# EAGLE design ACNode (EAGLE 6.1)
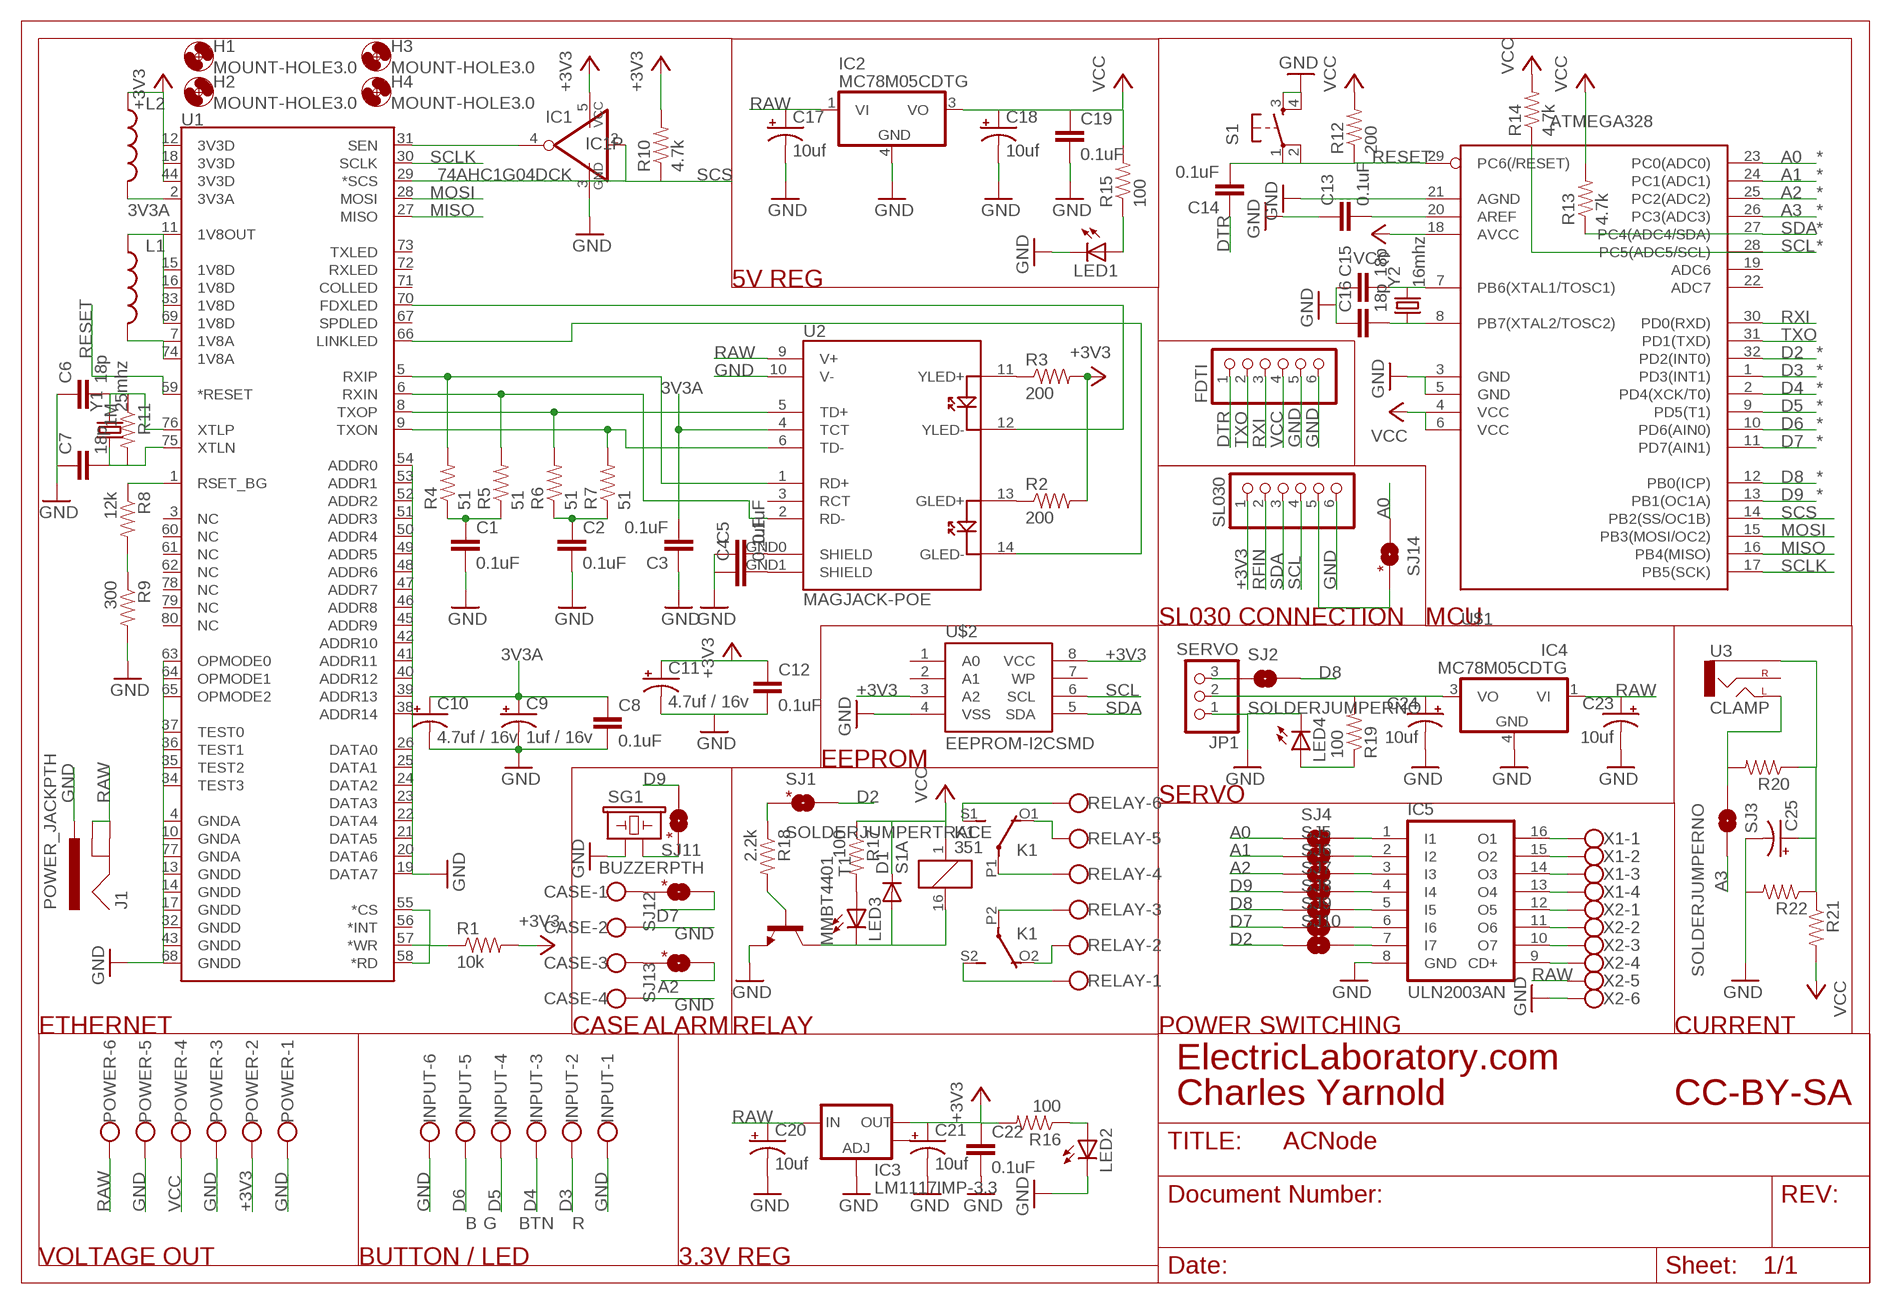
[diagram p0: schematic, sheet 1]

## Parts
C1  0.1uF  CAP0603-CAP  [0603-CAP]
C2  0.1uF  CAP0603-CAP  [0603-CAP]
C3  0.1uF  CAP0603-CAP  [0603-CAP]
C4  0.1uF  CAP0603-CAP  [0603-CAP]
C5  0.1uF  CAP0603-CAP  [0603-CAP]
C6  18p  CAP0603-CAP  [0603-CAP]
C7  18p  CAP0603-CAP  [0603-CAP]
C8  0.1uF  CAP0603-CAP  [0603-CAP]
C9  1uf / 16v  CAP_POL1206  [EIA3216]
C10  4.7uf / 16v  CAP_POL1206  [EIA3216]
C11  4.7uf / 16v  CAP_POL1206  [EIA3216]
C12  0.1uF  CAP0603-CAP  [0603-CAP]
C13  0.1uF  CAP0603-CAP  [0603-CAP]
C14  0.1uF  CAP0603-CAP  [0603-CAP]
C15  18p  CAP0603-CAP  [0603-CAP]
C16  18p  CAP0603-CAP  [0603-CAP]
C17  10uf  CAP_POL1206  [EIA3216]
C18  10uf  CAP_POL1206  [EIA3216]
C19  0.1uF  CAP0603-CAP  [0603-CAP]
C20  10uf  CAP_POL1206  [EIA3216]
C21  10uf  CAP_POL1206  [EIA3216]
C22  0.1uF  CAP0603-CAP  [0603-CAP]
C23  10uf  CAP_POL1206  [EIA3216]
C24  10uf  CAP_POL1206  [EIA3216]
C25  CAP_POL1206  [EIA3216]
CASE  W237-4  [W237-4]
D1  S1A  DIODE-DO-214AC  [DO-214AC]
FDTI  PINHD-1X6  [1X06]
H1  MOUNT-HOLE3.0  [3,0]
H2  MOUNT-HOLE3.0  [3,0]
H3  MOUNT-HOLE3.0  [3,0]
H4  MOUNT-HOLE3.0  [3,0]
IC1  74AHC1G04DCK  [SC70-5]
IC2  MC78M05CDTG  [DPACK_3]
IC3  LM1117IMP-3.3  V_REG_LM1117SOT223  [SOT223]
IC4  MC78M05CDTG  [DPACK_3]
IC5  ULN2003AN  [DIL16]
INPUT  W237-6  [W237-6]
J1  POWER_JACKPTH  [POWER_JACK_PTH]
JP1  SERVO  PINHD-1X3  [1X03]
K1  351  [351]
L1  INDUCTOR1206H*  [INDUCTOR-1206]
L2  INDUCTOR1206H*  [INDUCTOR-1206]
LED1  LED0603  [LED-0603]
LED2  LED0603  [LED-0603]
LED3  LED0603  [LED-0603]
LED4  LED0603  [LED-0603]
POWER  W237-6  [W237-6]
R1  10k  RESISTOR0603-RES  [0603-RES]
R2  200  RESISTOR0603-RES  [0603-RES]
R3  200  RESISTOR0603-RES  [0603-RES]
R4  51  RESISTOR0603-RES  [0603-RES]
R5  51  RESISTOR0603-RES  [0603-RES]
R6  51  RESISTOR0603-RES  [0603-RES]
R7  51  RESISTOR0603-RES  [0603-RES]
R8  12k  RESISTOR0603-RES  [0603-RES]
R9  300  RESISTOR0603-RES  [0603-RES]
R10  4.7k  RESISTOR0603-RES  [0603-RES]
R11  1M  RESISTOR0603-RES  [0603-RES]
R12  200  RESISTOR0603-RES  [0603-RES]
R13  4.7k  RESISTOR0603-RES  [0603-RES]
R14  4.7k  RESISTOR0603-RES  [0603-RES]
R15  100  RESISTOR0603-RES  [0603-RES]
R16  100  RESISTOR0603-RES  [0603-RES]
R17  100  RESISTOR0603-RES  [0603-RES]
R18  2.2k  RESISTOR0603-RES  [0603-RES]
R19  100  RESISTOR0603-RES  [0603-RES]
R20  RESISTOR0603-RES  [0603-RES]
R21  RESISTOR0603-RES  [0603-RES]
R22  RESISTOR0603-RES  [0603-RES]
RELAY  W237-6  [W237-6]
S1  TAC_SWITCHSMD  [TACTILE_SWITCH_SMD]
SG1  BUZZERPTH  [BUZZER-12MM]
SJ1  SOLDERJUMPERTRACE  [SJ_2S-TRACE]
SJ2  SOLDERJUMPERNO  [SJ_2S-NO]
SJ3  SOLDERJUMPERNO  [SJ_2S-NO]
SJ4  SOLDERJUMPERNO  [SJ_2S-NO]
SJ5  SOLDERJUMPERNO  [SJ_2S-NO]
SJ6  SOLDERJUMPERNO  [SJ_2S-NO]
SJ7  SOLDERJUMPERNO  [SJ_2S-NO]
SJ8  SOLDERJUMPERNO  [SJ_2S-NO]
SJ9  SOLDERJUMPERNO  [SJ_2S-NO]
SJ10  SOLDERJUMPERNO  [SJ_2S-NO]
SJ11  SOLDERJUMPERTRACE  [SJ_2S-TRACE]
SJ12  SOLDERJUMPERTRACE  [SJ_2S-TRACE]
SJ13  SOLDERJUMPERTRACE  [SJ_2S-TRACE]
SJ14  SOLDERJUMPERTRACE  [SJ_2S-TRACE]
SL030  PINHD-1X6  [1X06]
T1  MMBT4401  MMBT4401LT1-NPN-SOT23-BEC  [SOT23-BEC]
U1  W5100  [LQFP-80]
U2  MAGJACK-POE  [MAGJACK-POE]
U3  CLAMP  AUDIO-JACKPTH  [AUDIO-JACK]
U$1  ATMEGA328  AVR-MEGA8-AI  [TQFP32-08]
U$2  EEPROM-I2CSMD  [SO08]
X1  W237-4  [W237-4]
X2  W237-6  [W237-6]
Y1  25mhz  CRYSTALSMD  [HC49UP]
Y2  16mhz  CRYSTALSMD  [HC49UP]

## Nets
3V3A: C3.2 C8.1 C9.A(+) C10.A(+) L2.P$2 U1.2(3V3A) U2.4(TCT)
+3V3: C11.A(+) C12.1 C21.A(+) C22.1 IC1.5(VCC) IC3.2(OUT) L2.P$1 POWER.2 R1.2 R2.2 R3.2 R10.2 R16.2 SL030.1 U1.12(3V3D) U1.18(3V3D) U1.44(3V3D) U$2.3(A2) U$2.8(VCC)
A0: SJ4.1 SJ14.1 U$1.23(PC0(ADC0))
A1: SJ5.1 U$1.24(PC1(ADC1))
A2: SJ6.1 SJ13.2 U$1.25(PC2(ADC2))
A3: SJ3.2 U$1.26(PC3(ADC3))
D2: SJ1.2 SJ10.1 U$1.32(PD2(INT0))
D3: INPUT.2 U$1.1(PD3(INT1))
D4: INPUT.3 U$1.2(PD4(XCK/T0))
D5: INPUT.4 U$1.9(PD5(T1))
D6: INPUT.5 U$1.10(PD6(AIN0))
D7: SJ9.1 SJ12.2 U$1.11(PD7(AIN1))
D8: SJ2.2 SJ8.1 U$1.12(PB0(ICP))
D9: SJ7.1 SJ11.2 U$1.13(PB1(OC1A))
DTR: C14.1 FDTI.1
GND: C1.2 C2.2 C3.1 C4.1 C5.1 C6.1 C7.1 C8.2 C9.C(-) C10.C(-) C11.C(-) C12.2 C13.1 C15.1 C16.1 C17.C(-) C18.C(-) C19.2 C20.C(-) C21.C(-) C22.2 C23.C(-) C24.C(-) C25.C(-) CASE.2 CASE.4 FDTI.5 FDTI.6 IC1.3(GND) IC2.4(GND) IC3.1(ADJ) IC4.4(GND) IC5.8(GND) INPUT.1 INPUT.6 J1.PWR JP1.1 LED1.C LED2.C LED4.C POWER.1 POWER.3 POWER.5 R9.2 R22.2 S1.3 S1.4 SG1.+ SL030.6 T1.E U1.4(GNDA) U1.10(GNDA) U1.13(GNDD) U1.14(GNDD) U1.17(GNDD) U1.19(DATA7) U1.20(DATA6) U1.21(DATA5) U1.22(DATA4) U1.23(DATA3) U1.24(DATA2) U1.25(DATA1) U1.26(DATA0) U1.32(GNDD) U1.34(TEST3) U1.35(TEST2) U1.36(TEST1) U1.37(TEST0) U1.38(ADDR14) U1.39(ADDR13) U1.40(ADDR12) U1.41(ADDR11) U1.42(ADDR10) U1.43(GNDD) U1.45(ADDR9) U1.46(ADDR8) U1.47(ADDR7) U1.48(ADDR6) U1.49(ADDR5) U1.50(ADDR4) U1.51(ADDR3) U1.52(ADDR2) U1.53(ADDR1) U1.54(ADDR0) U1.63(OPMODE0) U1.64(OPMODE1) U1.65(OPMODE2) U1.68(GNDD) U1.77(GNDA) U2.10(V-) U$1.3(GND) U$1.5(GND) U$1.21(AGND) U$2.4(VSS) X2.6
MISO: U1.27(MISO) U$1.16(PB4(MISO))
MOSI: U1.28(MOSI) U$1.15(PB3(MOSI/OC2))
N$1: IC1.4(O) U1.31(SEN)
N$2: C13.2 U$1.20(AREF)
N$3: C2.1 R6.1 R7.1
N$4: C1.1 R4.1 R5.1
N$5: L1.P$2 U1.7(1V8A) U1.74(1V8A)
N$6: L1.P$1 U1.11(1V8OUT) U1.15(1V8D) U1.16(1V8D) U1.33(1V8D) U1.69(1V8D)
N$7: R1.1 U1.55(*CS) U1.57(*WR) U1.58(*RD)
N$8: R8.2 R9.1
N$9: R6.2 U1.8(TXOP) U2.5(TD+)
N$10: R7.2 U1.9(TXON) U2.6(TD-)
N$11: R4.2 U1.5(RXIP) U2.1(RD+)
N$12: R5.2 U1.6(RXIN) U2.2(RD-)
N$13: R3.1 U2.11(YLED+)
N$14: R2.1 U2.13(GLED+)
N$15: R8.1 U1.1(RSET_BG)
N$16: U1.70(FDXLED) U2.12(YLED-)
N$17: U1.66(LINKLED) U2.14(GLED-)
N$18: C5.2 U2.GND0(SHIELD)
N$19: C4.2 U2.GND1(SHIELD)
N$20: C7.2 R11.2 U1.75(XTLN) Y1.1
N$21: C6.2 R11.1 U1.76(XTLP) Y1.2
N$22: C15.2 U$1.7(PB6(XTAL1/TOSC1)) Y2.2
N$23: SG1.- SJ11.1
N$24: C16.2 U$1.8(PB7(XTAL2/TOSC2)) Y2.1
N$25: K1.S2(3:S) RELAY.1
N$26: LED1.A R15.1
N$27: K1.O2(3:O) RELAY.2
N$28: LED2.A R16.1
N$29: K1.P2(3:P) RELAY.3
N$30: K1.P1(2:P) RELAY.4
N$31: K1.O1(2:O) RELAY.5
N$32: K1.S1(2:S) RELAY.6
N$33: LED3.A R17.2
N$34: D1.A K1.16 LED3.C T1.C
N$35: R18.2 T1.B
N$36: LED4.A R19.1
N$37: R18.1 SJ1.1
N$38: C24.A(+) IC4.3(VO) JP1.2 R19.2
N$39: JP1.3 SJ2.1
N$40: C25.A(+) R20.1 R21.1 R22.1 U3.SLEEVE
N$41: R20.2 SJ3.1 U3.TIP(LEFT)
N$42: IC5.16(O1) X1.1
N$43: IC5.15(O2) X1.2
N$44: IC5.14(O3) X1.3
N$45: IC5.13(O4) X1.4
N$46: IC5.12(O5) X2.1
N$47: IC5.11(O6) X2.2
N$48: IC5.10(O7) X2.3
N$49: IC5.9(CD+) X2.4
N$50: IC5.7(I7) SJ10.2
N$51: IC5.6(I6) SJ9.2
N$52: IC5.5(I5) SJ8.2
N$53: IC5.4(I4) SJ7.2
N$54: IC5.3(I3) SJ6.2
N$55: IC5.2(I2) SJ5.2
N$56: IC5.1(I1) SJ4.2
N$57: SJ14.2 SL030.5
N$58: CASE.1 SJ12.1
N$59: CASE.3 SJ13.1
RAW: C17.A(+) C20.A(+) C23.A(+) IC2.1(VI) IC3.3(IN) IC4.1(VI) J1.GND J1.GNDBREAK POWER.6 U2.9(V+) X2.5
RESET: C14.2 R12.1 S1.1 S1.2 U1.59(*RESET) U$1.29(PC6(/RESET))
RFIN: SL030.2
RXI: FDTI.3 U$1.30(PD0(RXD))
SCL: R14.1 SL030.4 U$1.28(PC5(ADC5/SCL)) U$2.6(SCL)
SCLK: U1.30(SCLK) U$1.17(PB5(SCK))
SCS: IC1.2(I) R10.1 U1.29(*SCS) U$1.14(PB2(SS/OC1B))
SDA: R13.1 SL030.3 U$1.27(PC4(ADC4/SDA)) U$2.5(SDA)
TXO: FDTI.2 U$1.31(PD1(TXD))
VCC: C18.A(+) C19.1 D1.C FDTI.4 IC2.3(VO) K1.1 POWER.4 R12.2 R13.2 R14.2 R15.2 R17.1 R21.2 U$1.4(VCC) U$1.6(VCC) U$1.18(AVCC)
Unconnected: IC3.4(OUT) U1.3(NC) U1.56(*INT) U1.60(NC) U1.61(NC) U1.62(NC) U1.67(SPDLED) U1.71(COLLED) U1.72(RXLED) U1.73(TXLED) U1.78(NC) U1.79(NC) U1.80(NC) U2.3(RCT) U3.RING(RIGHT) U$1.19(ADC6) U$1.22(ADC7) U$2.1(A0) U$2.2(A1) U$2.7(WP)

## Notes on the sheet
- *
- *
- *
- *
- *
- *
- 5V REG
- *
- *
- *
- *
- *
- *
- *
- *
- *
- SL030 CONNECTION | MCU
- EEPROM
- * | SERVO
- *
- *
- *
- ETHERNET | CASE | ALARM | RELAY | POWER SWITCHING | CURRENT
- ElectricLaboratory.com
- Charles Yarnold | CC-BY-SA
- B | G | BTN | R
- VOLTAGE OUT | BUTTON / LED | 3.3V REG

## Library data of the parts
C1-C8 C12-C16 C19 C22 = SparkFun-Passives:CAP: Capacitor Standard 0603 ceramic capacitor, and 0.1" leaded capacitor.
C9-C11 C17 C18 C20 C21 C23-C25 = SparkFun-Passives:CAP_POL: Capacitor Polarized These are standard SMD and PTH capacitors. Normally 10uF, 47uF, and 100uF in electrolytic and tantalum varieties. Always verify the external diameter of the through hole cap, it varies with capacity, voltage, and manufacturer. The EIA devices should be standard.
CASE X1 = con-wago-500:W237-4: WAGO SCREW CLAMP; OC_FARNELL: unknown; OC_NEWARK: unknown
D1 = diode:DIODE-: DIODE
FDTI SL030 = pinhead:PINHD-1X6: PIN HEADER
H1-H4 = holes:MOUNT-HOLE: MOUNTING HOLE with drill center marker
IC1 = 74xx-little-de:74*1G04: INVERTER Gate
IC2 IC4 = linear:MC78M: 500 mA Positive Voltage Regulators Source: Data sheet <http://www.onsemi.com/pub_link/Collateral/MC78M00-D.PDF>
IC3 = SparkFun-PowerIC:V_REG_LM1117: Voltage Regulator LM1117 Standard adjustable voltage regulator but in SMD form. Spark Fun Electronics SKU : COM-00595
IC5 = uln-udn:ULN2003A: DRIVER ARRAY
INPUT POWER RELAY X2 = con-wago-500:W237-6: WAGO SCREW CLAMP; OC_FARNELL: unknown; OC_NEWARK: unknown
J1 = SparkFun-Connectors:POWER_JACK: Power Jack This is the standard 5.5mm barrel jack for power. The PTH is the most common, proven, reliable, footprint. All others are experimental. The Slot footprint only works if the mill layer is transmitted to the PCB fab house so be warned. Spark Fun Electronics SKU : PRT-00119. Mating wall wart : TOL-00298 (and others)
JP1 = pinhead:PINHD-1X3: PIN HEADER
K1 = relay:351: RELAY 2 x switch, Omron; OC_FARNELL: unknown; OC_NEWARK: unknown
L1 L2 = SparkFun-Passives:INDUCTOR: Inductors Basic Inductor/Choke - 0603 and 1206. Footprints are not proven and vary greatly between part numbers.
LED1-LED4 = SparkFun-LED:LED: LEDs Standard schematic elements and footprints for 5mm, 3mm, 1206, and 0603 sized LEDs. 5mm - Spark Fun Electronics SKU : COM-00529 (and others)
R1-R22 = SparkFun-Passives:RESISTOR: Resistor Basic schematic elements and footprints for 0603, 1206, and PTH resistors.
S1 = SparkFun-Electromechanical:TAC_SWITCH: Momentary Switch Button commonly used for reset or general input. Spark Fun Electronics SKU : COM-00097
SG1 = SparkFun-Electromechanical:BUZZER: Buzzer 12mm Spark Fun Electronics SKU : Comp-Buzzer
SJ1-SJ14 = SparkFun-Passives:SOLDERJUMPER: Solder Jumper Standard SMD solder jumper. Used to automate production. Two varients : Normally Open and Normally Closed are the same, but have different paste layers. NC will have a large amount of paste and should jumper during reflow.
T1 = transistor:*-NPN-: NPN Transistror BF959 corrected 2008.03.06
U1 = SparkFun-DigitalIC:W5100: WIZnet W5100 TCP/IP PHY Embedded Chip See SparkFun catalog # COM-09471 Package: LQFP-80,10x10mm, 0.4mm pitch
U2 = SparkFun-Connectors:MAGJACK-POE: PoE compatible MagJack
U3 = SparkFun-Connectors:AUDIO-JACK: 3.5mm Audio Jack Simple 3.5mm common PCB mount audio jack. SKU: PRT-08032
U$1 = SparkFun-DigitalIC:AVR-MEGA8: MICROCONTROLLER 8 Kbytes FLASH 1 kbytes SRAM 512 bytes EEPROM USART 6-channel 10 bit ADC 2-channel 8 bit ADC
U$2 = SparkFun-DigitalIC:EEPROM-I2C: I2C EEPROM chips, 24LC256 (and others)
Y1 Y2 = SparkFun-FreqCtrl:CRYSTAL: Various standard crystals. Proven footprints. Spark Fun Electronics SKU : COM-00534

## Board
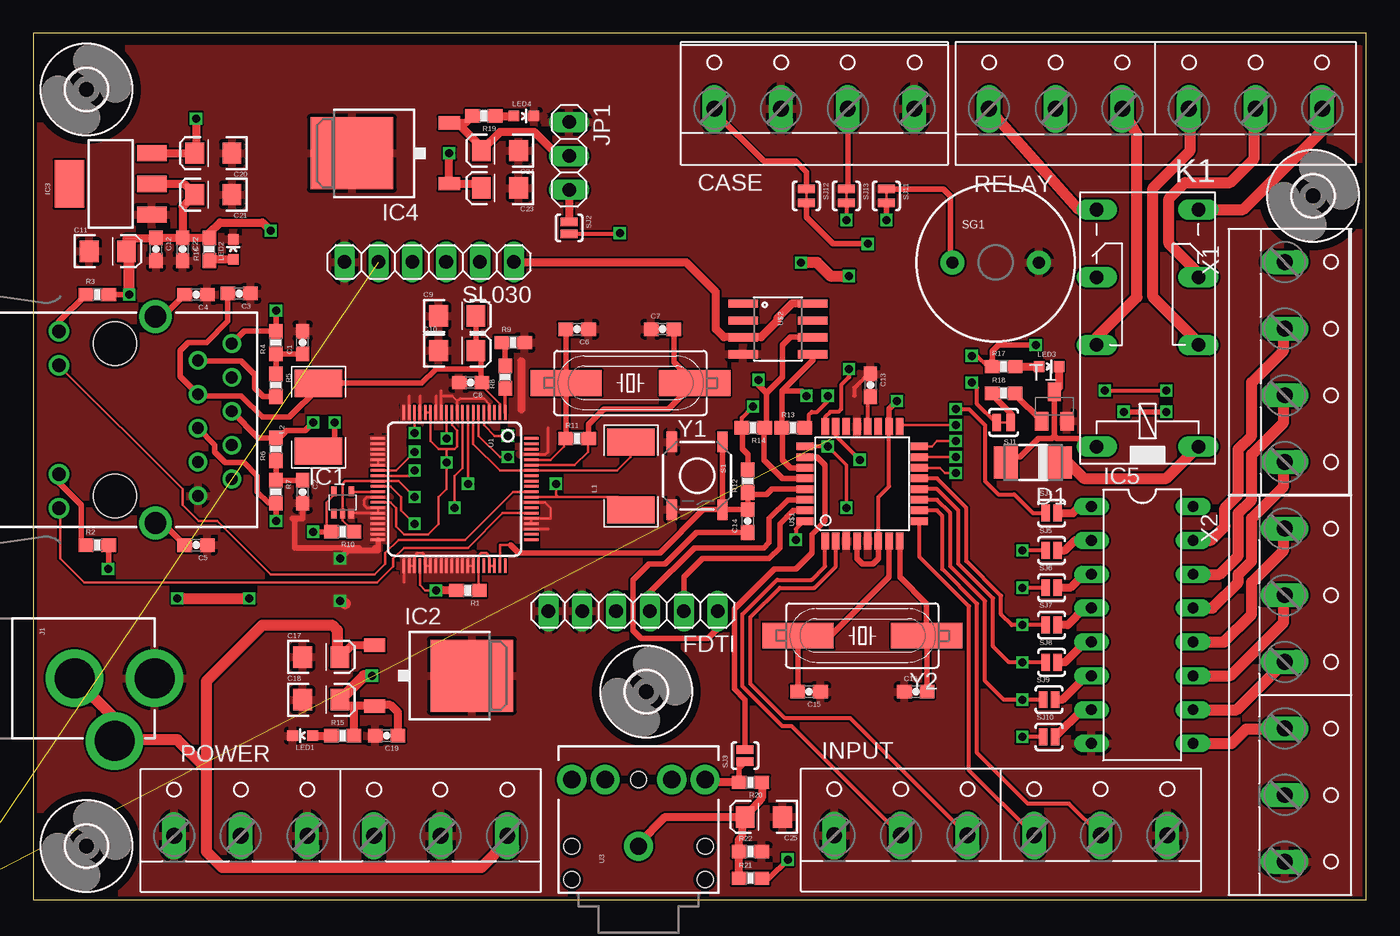
[diagram p1: board, top side]
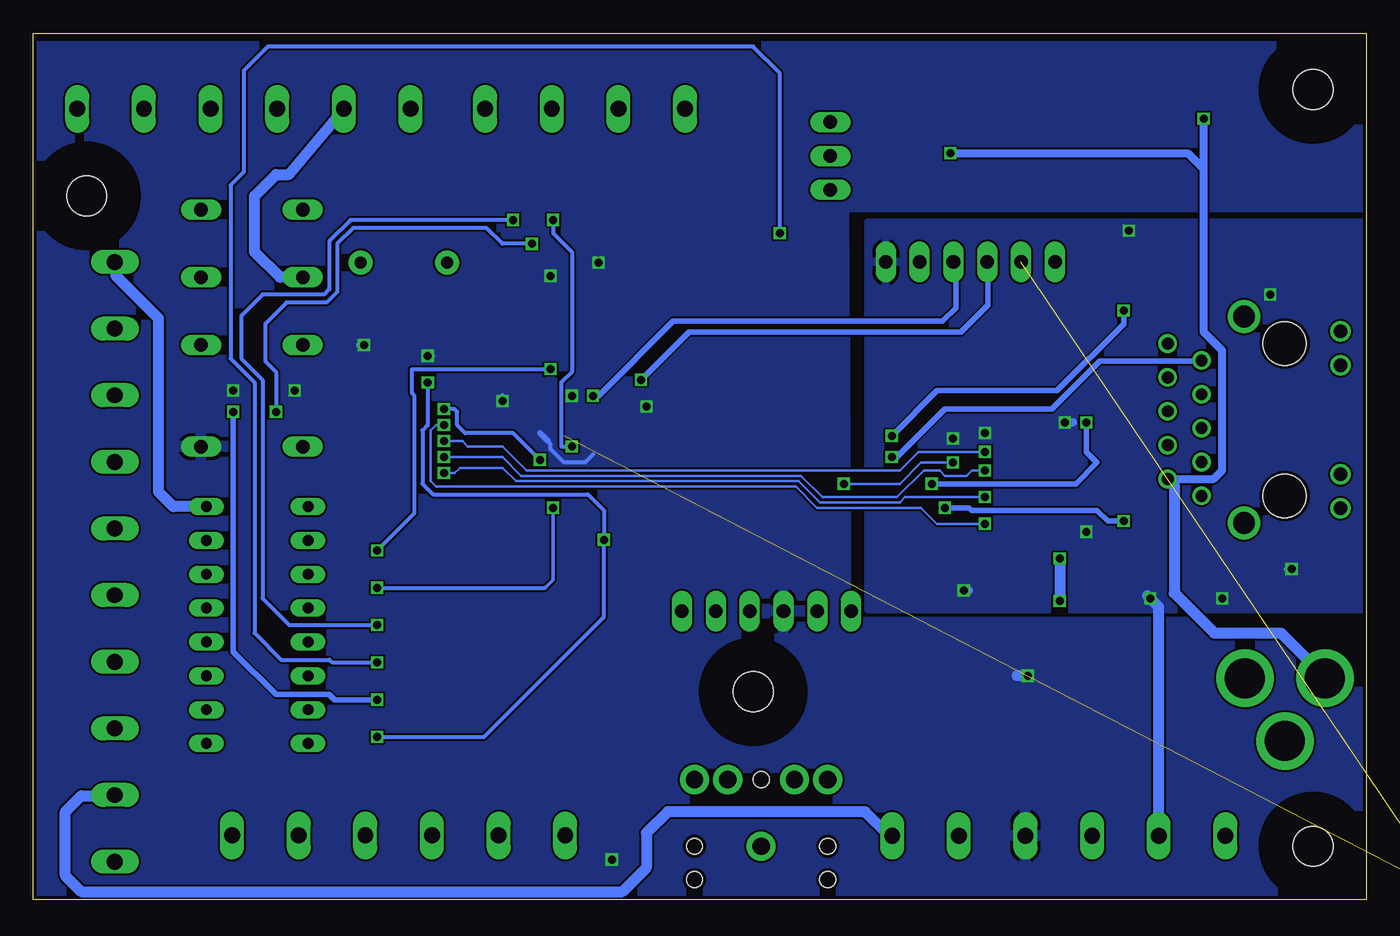
[diagram p2: board, bottom side, seen from below]

Size 100 x 65 mm. Coordinates in mm from the lower left corner, seen from the top.
Outline: 0,0 100,0 100,65 0,65 0,0
Copper layers (1*16): Top 0.035mm / dielectric 1.5mm / Bottom 0.035mm
Design rules: minimum track width 6mil, minimum drill 12mil, track to track 6mil, track to pad 6mil, pad to pad 6mil, via to via 6mil, smd to smd 0mil, copper to edge 10mil, drill to drill 10mil, minimum pad ring 10mil, minimum via ring 6mil, stop-mask expansion 2mil, vias tented up to drill 100mil, thermal gap 10mil

### Footprints (pad centres in the part's own frame; a part is rotated, then mirrored left to right if it is on the bottom)
0603-CAP = smd 1.1 x 1: 1 -0.85,0; 2 0.85,0
EIA3216 = smd 1.4 x 1.6: A 1.4,0; C -1.4,0
W237-4 = drill 1.194 long: 1 -7.5,-1.27; 2 -2.5,-1.27; 3 2.5,-1.27; 4 7.5,-1.27
DO-214AC = smd 1.8 x 2.4: A 2.025,0; C -2.025,0
1X06 = drill 1.016 long: 1 -6.35,0; 2 -3.81,0; 3 -1.27,0; 4 1.27,0; 5 3.81,0; 6 6.35,0
3,0 = hole 3: 0,0
SC70-5 = smd 0.4 x 0.7: 1 -0.65,-0.85; 2 0,-0.85; 3 0.65,-0.85; 4 0.65,0.85; 5 -0.65,0.85
DPACK_3 = smd 1 x 1.6: 1 -2.28,-4.8; 3 2.28,-4.8 | smd 5.4 x 6.2: 4 0,2.5
SOT223 = smd 1.219 x 2.235: 1 -2.311,-3.099; 2 0,-3.099; 3 2.311,-3.099 | smd 3.6 x 2.2: 4 0,3.099
DIL16 = drill 0.813 long: 1 -8.89,-3.81; 2 -6.35,-3.81; 3 -3.81,-3.81; 4 -1.27,-3.81; 5 1.27,-3.81; 6 3.81,-3.81; 7 6.35,-3.81; 8 8.89,-3.81; 9 8.89,3.81; 10 6.35,3.81; 11 3.81,3.81; 12 1.27,3.81; 13 -1.27,3.81; 14 -3.81,3.81; 15 -6.35,3.81; 16 -8.89,3.81
W237-6 = drill 1.194 long: 1 -12.5,-1.27; 2 -7.5,-1.27; 3 -2.5,-1.27; 4 2.5,-1.27; 5 7.5,-1.27; 6 12.5,-1.27
POWER_JACK_PTH = drill 2.997 pad 4.318: GND 0,7.7; GNDBREAK 4.7,10.7; PWR 0,13.7
1X03 = drill 1.016 long: 1 -2.54,0; 2 0,0; 3 2.54,0
351 = drill 1.016 long: 1 -3.81,-3.81; 16 -3.81,3.81; O1 8.89,-3.81; O2 8.89,3.81; P1 3.81,-3.81; P2 3.81,3.81; S1 13.97,-3.81; S2 13.97,3.81
INDUCTOR-1206 = smd 2.032 x 3.556: P$1 -2.54,0; P$2 2.54,0
LED-0603 = smd 0.8 x 0.8: A 0,-0.75; C 0,0.75
0603-RES = smd 1.1 x 1: 1 -0.85,0; 2 0.85,0
TACTILE_SWITCH_SMD = smd 1.524 x 0.762: 1 -2.54,1.905; 2 2.54,1.905; 3 -2.54,-1.905; 4 2.54,-1.905
BUZZER-12MM = drill 0.9 pad 1.778: + 3.25,0; - -3.25,0
SJ_2S-TRACE = smd 0.635 x 1.27: 1 -0.508,0; 2 0.508,0
SJ_2S-NO = smd 0.635 x 1.27: 1 -0.45,0; 2 0.45,0
SOT23-BEC = smd 1 x 1.4: B -0.95,-1.1; C 0,1.1; E 0.95,-1.1
LQFP-80 = smd 0.19 x 1.1: 1 -3.8,-5.75; 2 -3.4,-5.75; 3 -3,-5.75; 4 -2.6,-5.75; 5 -2.2,-5.75; 6 -1.8,-5.75; 7 -1.4,-5.75; 8 -1,-5.75; 9 -0.6,-5.75; 10 -0.2,-5.75; 11 0.2,-5.75; 12 0.6,-5.75; 13 1,-5.75; 14 1.4,-5.75; 15 1.8,-5.75; 16 2.2,-5.75; 17 2.6,-5.75; 18 3,-5.75; 19 3.4,-5.75; 20 3.8,-5.75; 41 3.8,5.75; 42 3.4,5.75; 43 3,5.75; 44 2.6,5.75; 45 2.2,5.75; 46 1.8,5.75; 47 1.4,5.75; 48 1,5.75; 49 0.6,5.75; 50 0.2,5.75; 51 -0.2,5.75; 52 -0.6,5.75; 53 -1,5.75; 54 -1.4,5.75; 55 -1.8,5.75; 56 -2.2,5.75; 57 -2.6,5.75; 58 -3,5.75; 59 -3.4,5.75; 60 -3.8,5.75 | smd 1.1 x 0.19: 21 5.75,-3.8; 22 5.75,-3.4; 23 5.75,-3; 24 5.75,-2.6; 25 5.75,-2.2; 26 5.75,-1.8; 27 5.75,-1.4; 28 5.75,-1; 29 5.75,-0.6; 30 5.75,-0.2; 31 5.75,0.2; 32 5.75,0.6; 33 5.75,1; 34 5.75,1.4; 35 5.75,1.8; 36 5.75,2.2; 37 5.75,2.6; 38 5.75,3; 39 5.75,3.4; 40 5.75,3.8; 61 -5.75,3.8; 62 -5.75,3.4; 63 -5.75,3; 64 -5.75,2.6; 65 -5.75,2.2; 66 -5.75,1.8; 67 -5.75,1.4; 68 -5.75,1; 69 -5.75,0.6; 70 -5.75,0.2; 71 -5.75,-0.2; 72 -5.75,-0.6; 73 -5.75,-1; 74 -5.75,-1.4; 75 -5.75,-1.8; 76 -5.75,-2.2; 77 -5.75,-2.6; 78 -5.75,-3; 79 -5.75,-3.4; 80 -5.75,-3.8
MAGJACK-POE = drill 0.89: 1 5.72,-8.89; 2 4.45,-6.35; 3 3.18,-8.89; 4 1.91,-6.35; 5 0.64,-8.89; 6 -0.63,-6.35; 7 -1.9,-8.89; 8 -3.17,-6.35; 9 -4.44,-8.89; 10 -5.71,-6.35 | drill 1.02: 11 6.625,4.08; 12 4.085,4.08; 13 -4.085,4.08; 14 -6.625,4.08 | drill 1.63: GND0 -7.745,-3.17; GND1 7.745,-3.17 | hole 3.25: -5.715,-0.12; 5.715,-0.12
AUDIO-JACK = drill 1.3 pad 2.184: RING 5,5; RSH 5,2.5; SLEEVE 0,0; TIP 5,-5; TSH 5,-2.5 | hole 1.2: 0,5; -2.5,5; -2.5,-5; 0,-5; 5,0
TQFP32-08 = smd 1.27 x 0.559: 1 -4.293,2.8; 2 -4.293,2; 3 -4.293,1.2; 4 -4.293,0.4; 5 -4.293,-0.4; 6 -4.293,-1.2; 7 -4.293,-2; 8 -4.293,-2.8; 17 4.293,-2.8; 18 4.293,-2; 19 4.293,-1.2; 20 4.293,-0.4; 21 4.293,0.4; 22 4.293,1.2; 23 4.293,2; 24 4.293,2.8 | smd 0.559 x 1.27: 9 -2.8,-4.293; 10 -2,-4.293; 11 -1.2,-4.293; 12 -0.4,-4.293; 13 0.4,-4.293; 14 1.2,-4.293; 15 2,-4.293; 16 2.8,-4.293; 25 2.8,4.293; 26 2,4.293; 27 1.2,4.293; 28 0.4,4.293; 29 -0.4,4.293; 30 -1.2,4.293; 31 -2,4.293; 32 -2.8,4.293
SO08 = smd 0.61 x 2.21: 1 -1.905,-2.616; 2 -0.635,-2.616; 3 0.635,-2.616; 4 1.905,-2.616; 5 1.905,2.616; 6 0.635,2.616; 7 -0.635,2.616; 8 -1.905,2.616
HC49UP = smd 5.334 x 1.93: 1 -4.826,0; 2 4.826,0

### Placement (x,y rotation side)
C1  20.2,41.8 90 top
C2  20.2,30.6 270 top
C3  15.44,45.48 180 top
C4  12.2,45.4 180 top
C5  12.2,26.6 180 top
C6  40.8,42.8 180 top
C7  47.2,42.8 0 top
C8  32.8,38.8 180 top
C9  31.8,43.8 0 top
C10  31.8,41.2 0 top
C11  5.59,48.64 0 top
C12  9.2,48.8 270 top
C13  62.8,38.6 270 top
C14  53.6,28.4 90 top
C15  58.2,15.6 180 top
C16  66.2,15.6 0 top
C17  21.6,18.2 0 top
C18  21.6,15 0 top
C19  26.5,12.3 180 top
C20  13.5,56 180 top
C21  13.5,52.9 180 top
C22  11.2,48.8 270 top
C23  35,53.4 180 top
C24  35,56.2 180 top
C25  54.8,6.2 180 top
CASE  58.6,60.6 0 top
D1  75,32.8 180 top
FDTI  44.99,21.64 180 top
H1  46,15.6 0 top
H2  96,52.8 0 top
H3  4,60.8 0 top
H4  4,4 0 top
IC1  23.2,29.8 0 top
IC2  30.4,16.8 270 top
IC3  5.8,53.7 90 top
IC4  26.4,56 90 top
IC5  83.2,20.6 270 top
INPUT  72.59,6.08 0 top
J1  -4.6,16.6 270 top
JP1  40.2,55.8 270 top
K1  83.6,37.8 90 top
L1  44.84,31.78 90 top
L2  21.4,36.2 90 top
LED1  20.2,12.3 90 top
LED2  15,48.8 0 top
LED3  76.2,40 270 top
LED4  36.8,58.8 270 top
POWER  23.06,6.05 0 top
R1  32.6,23.2 180 top
R2  4.8,26.6 0 top
R3  4.8,45.4 0 top
R4  18.2,41.8 90 top
R5  18.2,38.6 270 top
R6  18.2,33.8 90 top
R7  18.2,30.6 270 top
R8  35.4,39.2 90 top
R9  36,41.8 0 top
R10  23.2,27.6 180 top
R11  40.8,34.6 0 top
R12  53.6,31.4 90 top
R13  57,35.4 0 top
R14  54,35.4 180 top
R15  23.2,12.3 0 top
R16  13.2,48.8 90 top
R17  72.8,40 0 top
R18  72.8,38 0 top
R19  33.8,58.8 180 top
R20  53.8,8.8 180 top
R21  53.8,1.6 0 top
R22  53.8,3.6 0 top
RELAY  84.2,60.6 0 top
S1  49.8,31.8 270 top
SG1  72.2,47.8 0 top
SJ1  72.8,35.8 180 top
SJ2  40.2,50.4 270 top
SJ3  53.4,10.8 90 top
SJ4  76.4,29 0 top
SJ5  76.4,26.2 0 top
SJ6  76.4,23.4 0 top
SJ7  76.4,20.6 0 top
SJ8  76.4,17.8 0 top
SJ9  76.2,15 0 top
SJ10  76.2,12.2 0 top
SJ11  64,52.8 270 top
SJ12  58,52.8 270 top
SJ13  61,52.8 270 top
SJ14  -7.2,-0.4 0 top  (outside the outline)
SL030  29.7,47.84 180 top
T1  76.6,37 0 top
U1  31.6,30.8 180 top
U2  6,36 90 top
U3  45.4,4 90 top
U$1  62.2,31.2 90 top
U$2  55.87,42.82 270 top
X1  95.15,40.34 270 top
X2  95.15,15.34 270 top
Y1  44.8,38.76 180 top
Y2  62.2,19.8 180 top

### Tracks (layer width: path | path; a pad name or v marks a point on that pad's centre or on a via)
3V3A
  Top 0.2: U1.2 35,37.2 33.65,38.55 C8.1
  Top 0.406: C8.1 33.6,38.85 33.6,40 | 33.6,40 33.6,40.8 C10.A C9.A | 33.6,40 33.4,39.8 30.2,39.8 29.14,38.74 L2.P$2 21.4,38.4 19.2,36.2 17.2,36.2 15.6,37.8 12.46,37.8 U2.4 11,39.26 11,41.2 11.6,41.8 13,41.8 14.59,43.39 C3.2
+3V3  (via drill 0.6)
  Top 0.2: IC1.5 22.55,30.35 22,29.8 22,27.95 R10.2 | U1.44 29,23.6 29.4,23.2 v30.2,23.2 | U1.18 v28.6,35 | U1.12 v31,34.6
  Top 0.305: 13.2,49.8 R16.2 | U$2.8 58.56,44.8
  Top 0.406: R3.2 v7.2,45.4 | v21,27.6 22,27.6 22,27.95 | v5.6,24.8 5.65,24.85 R2.2 | 21.6,33.86 L2.P$1 21.54,33.8 22.4,33.8 22.6,34 v22.6,35.8
  Top 0.61: 8.9,53.85 IC3.2 11.3,53.7 C21.A 11.2,52 C22.1 | C22.1 11.2,49.6 | R16.2 C22.1 | C22.1 C12.1 9.15,49.6 7,49.6 6.99,49.59 C11.A | R1.2 v30.2,23.2 | 13.2,49.8 13.2,50 14,50.8 17.2,50.8 v17.8,50.2 | U$2.8 56.92,44.73 55.8,43.6 55.8,43.4 54.6,42.2 53.27,42.2 | 53.27,42.2 U$2.3 | 53.27,42.2 51.8,42.2 51.2,42.8 51.2,45.6 49,47.8 36.09,47.8 SL030.1
  Top 0.813: v7.2,45.4 7.2,48 6.99,48.21 C11.A | v10.8,22.6 v16.2,22.6
  Bottom 0.2: v28.6,35 28.8,34.6 | v31,34.6 30.8,34.8
  Bottom 0.406: v5.6,24.8 6,24.8
  Bottom 0.61: v30.2,23.2 29.8,23.2 | v22.6,35.8 22,35.8
  Bottom 0.813: POWER.2 15.56,21.96 v16.2,22.6 16.4,22.8
  pour Bottom: 0,50.8 37.4,50.8 37.4,21.8 0,21.8
A0  (via drill 0.6)  (1 unrouted)
  Top 0.305: U$1.23 60.2,34.8 v62,33 | v69.2,36.8 70.2,36.8 71.4,35.6 71.4,31.4 72.4,30.4 73.6,30.4 75,29 SJ4.1
  Bottom 0.305: v62,33 64,35 67.6,35 68.2,35.6 68.2,36.6 68.4,36.8 v69.2,36.8
A1  (via drill 0.6)
  Top 0.305: SJ5.1 v74.2,26.2 | v61.2,39.8 61.2,39.2 60.6,38.6 60.6,36.8 60.4,36.6 59.8,36.6 59.4,36.2 U$1.24
  Bottom 0.305: v74.2,26.2 71.4,29 71.4,37.8 71.6,38 71.6,39.8 v61.2,39.8
A2  (via drill 0.6)
  Top 0.254: v61,29.4 61,32.6 v59.6,34
  Top 0.305: SJ6.1 v74.2,23.4 | v59.6,34 U$1.25 | SJ13.2 v61,51
  Bottom 0.254: v61,29.4 61,24 61.6,23.4
  Bottom 0.305: v74.2,23.4 61.6,23.4 | v61,51 61,50 59.6,48.6 59.6,39.6 60.4,38.8 60.4,34 v59.6,34
A3
  Top 0.406: U$1.26 58.8,33.2 59.4,32.6 59.4,28.4 58.4,27.4 58.4,26 57.2,24.8 55.6,24.8 52.6,21.8 52.6,15.8 53.4,15 SJ3.2
D2  (via drill 0.6)
  Top 0.305: SJ10.1 v74.2,12.2 | 58,28.31 U$1.32 57.8,28.4 57.2,27.8 v57.2,27 | SJ1.2 72.2,35.8 70.8,37.2 70.8,38.4 v70.4,38.8
  Bottom 0.305: v70.4,38.8 70.4,35.6 70.8,35.2 70.8,31.2 70,30.4 58.4,30.4 57.2,29.2 v57.2,27 57.2,21.2 66.2,12.2 v74.2,12.2
D3
  Top 0.305: INPUT.2 56.9,13 56.2,13 53.2,16 53.2,21.4 55.8,24 58.4,24 59.4,25 U$1.1
D4
  Top 0.305: INPUT.3 61.3,13.6 56.4,13.6 53.8,16.2 53.8,21.2 56,23.4 58.6,23.4 60.2,25 U$1.2
D5
  Top 0.305: INPUT.4 70.2,9.7 70.2,22 66.49,25.71 U$1.9
D6
  Top 0.305: INPUT.5 77.7,7.2 74.6,7.2 70.8,11 70.8,22.2 68.2,24.8 68.2,28.8 67.8,29.2 U$1.10
D7  (via drill 0.6)
  Top 0.305: SJ9.1 v74.2,15 72.8,15 71.4,16.4 71.4,22.4 68.8,25 68.8,29 67.8,30 U$1.11
  Top 0.406: SJ12.2 58,51.2 60,49.2 v62.6,49.2 | v81.8,36.6 v85,36.6 | 66.4,30 U$1.11
  Bottom 0.305: v62.6,49.2 64.8,49.2 66,50.4 76,50.4 77.2,49.2 77.2,45.6 78,44.8 81,44.8 82.6,43.2 82.6,40.4 81.8,39.6 v81.8,36.6
  Bottom 0.406: v85,36.6 85,18.6 81.8,15.4 77.8,15.4 77.4,15 v74.2,15
D8  (via drill 0.6)
  Top 0.305: 76,17.8 SJ8.1 v74.2,17.8 73.2,17.8 72,19 72,22.6 69.4,25.2 69.4,29.2 67.8,30.8 U$1.12 | SJ2.2 43.95,49.95 v44,50
  Bottom 0.305: v44,50 44,62 46,64 82.4,64 84.2,62.2 84.2,54.6 85.2,53.6 85.2,40.6 83.4,38.8 83.4,20 81.4,18 77.8,18 77.6,17.8 v74.2,17.8
D9  (via drill 0.6)
  Top 0.305: 76,20.6 SJ7.1 v74.2,20.6 73.4,20.6 72.6,21.4 72.6,22.8 70,25.4 70,29.4 67.8,31.6 U$1.13
  Top 0.406: SJ11.2 v64,51
  Bottom 0.305: v64,51 76.2,51 77.8,49.4 77.8,45.8 78.2,45.4 82.8,45.4 84.4,43.8 84.4,40.6 82.8,39 82.8,22.6 80.8,20.6 v74.2,20.6
DTR
  Top 0.406: C14.1 49.75,27.55 47.4,25.2 46.2,25.2 45,24 45,20.2 45.6,19.6 50.6,19.6 51.4,20.4 51.4,21.58 FDTI.1
GND  (via drill 0.6)
  Top 0.2: U1.25 U1.26 | U1.53 U1.54 | U1.46 U1.45 29.4,25.8 29.2,26 28.8,26 28.6,25.8 U1.43 U1.42 | IC1.3 23.9,29 U1.35 U1.34 25,29.4 24.8,29.6 24.8,30 25,30.2 U1.32 | U1.17 29,37.8 | U1.14 30.2,37.8 | U1.13 30.6,37.8 | 30.6,37.8 30.6,38.2 | U1.41 27.8,23.8 | U1.63 38.6,27.8 | U1.64 U1.65 38.8,28.6 38.8,29.4 38.4,29.8 U1.68 | U1.10 31.8,37.4 | 31.8,37.4 31.4,37.8 30.6,37.8 | U1.4 34.2,37.2 33.8,37.6 32,37.6 31.8,37.4 | U1.77 38.4,33.4 38.6,33.6 38.6,35.4 | U1.19 28.2,37.8
  Top 0.305: C13.1 62.65,39.45 61.6,38.4 61.6,37.8
  Top 0.406: U1.40 25.85,26.4 | 25.85,26.4 25.6,26.4 | C2.2 20.2,28.6 19.8,28.6 | 19.8,28.6 19.4,28.6 | 25.85,26.4 25.85,26.2 24.6,26.2 | 19.8,28.6 19.6,28.4 19.6,26.4 24.4,26.4 24.6,26.2 | 24.6,26.2 23.6,26.2 v23,25.6
  Top 0.61: 36.6,40.4 36.6,36.8
  Top 0.813: v23,22.4 23.2,22.4 23.4,22.2
  Bottom 0.813: v23,25.6 v23,22.4
  pour Top: 0,0 100,0 99.6,63.8 -0.4,63.8
MISO  (via drill 0.6)
  Top 0.2: U1.27 27.2,32.2 v28.6,33.6 | U$1.16 67.4,34 67.8,34.4 v69.2,34.4
  Bottom 0.2: v28.6,33.6 33.6,33.6 35,32.2 63,32.2 64.8,34 67.4,34 67.8,34.4 v69.2,34.4
MOSI  (via drill 0.6)
  Top 0.2: U1.28 28.2,31.8 v28.6,32.2 | v69.2,33.2 U$1.15
  Bottom 0.2: v28.6,32.2 29.6,32.2 30,31.8 31.6,31.8 32,32.2 33.2,32.2 35.2,30.2 40.8,30.2 42.4,31.8 63.4,31.8 64.8,33.2 v69.2,33.2
N$1
  Top 0.2: U1.31 23.9,30.6 IC1.4
N$2
  Top 0.305: U$1.20 62.6,37.55 C13.2
N$3
  Top 0.406: R6.1 R7.1 C2.1
N$4
  Top 0.406: C1.1 R4.1 R5.1
N$5
  Top 0.2: L1.P$2 44.8,34.28 44.8,33.2 43.8,32.2 U1.74 35,32.2 33,34.2 U1.7
N$6  (via drill 0.6)
  Top 0.2: U1.69 39.4,30.2 | 39.4,30.2 43.88,30.2 L1.P$1 | U1.16 U1.15 29.8,34.4 30.4,33.8 31,33.8 | U1.11 31.4,35.6 31.8,35.2 31.8,34 31.6,33.8 31,33.8 | 31,33.8 v31,32.8 31,30.8 30.4,30.2 30.4,28.2 29.6,27.4 27.8,27.4 27.2,28 27.2,29.4 26.8,29.8 U1.33 | v39.2,31.2 39.2,30.4 39.4,30.2
  Bottom 0.2: v31,32.8 33.4,32.8 35,31.2 v39.2,31.2
N$7
  Top 0.2: U1.58 U1.57 34.2,25.8 34,26 33.6,26 33.4,25.8 U1.55 33.4,23.25 R1.1
N$8
  Top 0.406: R8.2 35.4,41.55 R9.1
N$9  (via drill 0.6)
  Top 0.2: U1.8 v32.6,31.2
  Top 0.406: U2.5 16.88,34.65 R6.2 18.45,34.65 19,35.2 20.4,35.2 v21,35.8
  Bottom 0.406: v32.6,31.2 21.8,31.2 20.2,32.8 21,33.6 v21,35.8
N$10  (via drill 0.6)
  Top 0.2: U1.9 32.2,32.4 31.6,31.8 v31.6,29.4
  Top 0.406: U2.6 13.6,34.12 13.6,33.6 14.4,32.8 15.8,32.8 16.8,31.8 16.8,30.6 17.65,29.75 R7.2 v18.2,28.4
  Bottom 0.406: v18.2,28.4 19.4,28.4 20.2,29.2 29.6,29.2 29.8,29.4 v31.6,29.4
N$11  (via drill 0.6)
  Top 0.2: U1.5 33.8,35.6 34.6,34.8 v35.6,34.8
  Top 0.406: U2.1 15.82,42.65 R4.2 v18.2,44.2
  Bottom 0.406: v18.2,44.2 18.2,43.2 23.2,38.2 32.2,38.2 v35.6,34.8
N$12  (via drill 0.6)
  Top 0.2: U1.6 33.4,34.8 35,33.2 v35.6,33.2
  Top 0.406: U2.2 12.4,40.4 15.6,40.4 16.6,39.4 16.6,38.4 17.25,37.75 R5.2
  Bottom 0.406: v35.6,33.2 35.2,33.2 31.6,36.8 23.6,36.8 20,40.4 12.4,40.4 U2.2
N$13
  Top 0.406: U2.11 1.92,43.37 R3.1
N$14
  Top 0.406: R2.1 3.6,26.95 3.6,29.6 1.92,31.28 U2.13
N$15
  Top 0.254: U1.1 R8.1
  Top 0.305: 35.4,38.4 R8.1
N$16
  Top 0.2: U2.12 11.2,30.8 11.2,29.6 12.4,28.4 13.8,28.4 17.8,24.4 25.6,24.4 26.4,25.2 26.4,26 27.4,27 32.4,27 36,30.6 U1.70
N$17
  Top 0.2: U1.66 35.2,29 32.6,26.4 27.8,26.4 27,25.6 27,25 25.8,23.8 3.8,23.8 2,25.6 2,29.3 U2.14
N$18
  Top 0.406: C5.2 9.7,28.25 U2.GND0
N$19
  Top 0.406: C4.2 9.7,43.74 U2.GND1
N$20
  Top 0.2: U1.75 40.6,32.6 41.6,33.6 41.6,34.55 R11.2
  Top 0.406: Y1.1 49.65,38.78 | R11.2 41.65,35.65 42.8,36.8 47.67,36.8 Y1.1 | C7.2 48.05,40.34 Y1.1
N$21
  Top 0.2: U1.76 38.8,33 39.8,34 39.8,34.45 R11.1
  Top 0.406: C6.2 39.95,38.78 Y1.2 39.97,34.62 R11.1
N$22
  Top 0.406: U$1.7 64.2,24.2 59.8,19.8 Y2.2 57.37,15.62 C15.2
N$23
  Top 0.406: SJ11.1 68.29,53.31 68.8,52.8 68.8,47.95 SG1.-
N$24
  Top 0.406: U$1.8 65,24.2 67,22.2 67,19.83 Y2.1 67.03,15.62 C16.2
N$25
  Top 0.813: K1.S2 78.46,51.77 RELAY.1
N$26
  Top 0.61: LED1.A R15.1
N$27
  Bottom 0.813: K1.O2 81.49,46.69 83.4,48.6 83.4,52.8 81.8,54.4 80.83,54.4 RELAY.2
N$28
  Top 0.61: R16.1 13.3,48.05 LED2.A
N$29
  Top 0.813: K1.P2 79.79,42.19 82.8,45.2 82.8,57.43 RELAY.3
N$30
  Top 0.813: K1.P1 87.41,41.79 84,45.2 84,53.4 86.8,56.2 86.8,58.43 RELAY.4
N$31
  Top 0.813: K1.O1 87.41,46.99 85.2,49.2 85.2,52.6 86.4,53.8 89.8,53.8 91.6,55.6 91.6,58.43 RELAY.5
N$32
  Top 0.813: K1.S1 90.77,51.77 96.6,57.6 96.6,59.23 RELAY.6
N$33
  Top 0.61: R17.2 LED3.A
N$34
  Top 0.406: T1.C 76.6,34.8 | 76.6,34.8 76.4,34.6 75.4,34.6 74,33.2 73.38,33.2 D1.A | K1.16 79.01,33.99 78.4,34.6 76.8,34.6 76.6,34.8
  Top 0.61: LED3.C 76.95,38.45 T1.C
N$35
  Top 0.406: R18.2 73.65,37.9 T1.B
N$36
  Top 0.61: R19.1 LED4.A
N$37
  Top 0.406: R18.1 71.95,37.85 73.4,36.4 73.4,35.89 SJ1.1
N$38
  Top 0.61: IC4.3 31.8,58.28 | 31.8,58.28 32.43,58.28 R19.2 | 31.8,58.28 33.6,56.48 C24.A 35,57.6 37.6,57.6 39.4,55.8 JP1.2
N$39
  Top 0.61: JP1.3 SJ2.1
N$40
  Top 0.61: R20.1 54.65,7.65 C25.A | 52.95,5.95 C25.A | R21.1 R22.1 52.95,4.55 53.2,4.8 53.2,6 C25.A | U3.SLEEVE 45.4,4.2 47.4,6.2 C25.A
N$41
  Top 0.406: SJ3.1 52.95,9.9 R20.2
  Top 0.61: U3.TIP 50.6,8.8 R20.2 53,8.85
N$42
  Bottom 0.813: IC5.16 89.49,29.49 90.6,30.6 90.6,43.6 93.8,46.8 93.8,47.76 X1.1
N$43
  Top 0.813: IC5.15 88.35,26.95 89.4,28 89.4,29.4 90.4,30.4 90.4,33.8 91.4,34.8 91.4,38.8 93.8,41.2 93.8,42.76 X1.2
N$44
  Top 0.813: IC5.14 89.01,24.41 90.4,25.8 90.4,29 91.4,30 91.4,33.4 93.8,35.8 93.8,37.76 X1.3
N$45
  Top 0.813: IC5.13 88.47,21.87 90.4,23.8 90.4,24.4 91.4,25.4 91.4,28.6 93.8,31 93.8,32.76 X1.4
N$46
  Top 0.813: IC5.12 89.33,19.33 91.4,21.4 91.4,23.8 93.8,26.2 93.8,27.76 X2.1
N$47
  Top 0.813: IC5.11 89.79,16.79 93.8,20.8 93.8,22.76 X2.2
N$48
  Top 0.813: IC5.10 90.29,14.25 X2.3
N$49
  Top 0.813: IC5.9 89.91,11.71 91,12.8 93.84,12.8 X2.4
N$50
  Top 0.61: IC5.7 78.7,14.25 SJ10.2
N$51
  Top 0.61: IC5.6 78.99,16.79 77.2,15 SJ9.2
N$52
  Top 0.61: IC5.5 78.93,19.33 77.4,17.8 SJ8.2
N$53
  Top 0.61: IC5.4 78.87,21.87 77.6,20.6 SJ7.2
N$54
  Top 0.61: IC5.3 78.81,24.41 77.8,23.4 SJ6.2
N$55
  Top 0.61: SJ5.2 77.4,26.2 78.15,26.95 IC5.2
N$56
  Top 0.61: SJ4.2 78,29 78.49,29.49 IC5.1
N$57  (1 unrouted)
N$58
  Top 0.406: SJ12.1 58,54.6 57.2,55.4 54.8,55.4 51,59.2 51.2,59.4 51.2,59.23 | 51.2,59.2 51.2,59.23 | 51.2,59.23 CASE.1
N$59
  Top 0.406: CASE.3 61.1,53.41 SJ13.1
RAW  (via drill 0.6)
  Top 0.61: IC2.1 23.88,19.08 C17.A | C23.A 33.28,53.72 IC4.1 v31.2,56 | v12.2,58.6 12.2,56.2 | 12.2,56.2 12.2,56.1 C20.A | IC3.3 12.01,56.01 12.2,56.2
  Top 0.813: 22.8,18.6 C17.A 22.8,18.4 22.8,20.2 22.4,20.6 17.2,20.6 13,16.4 13,9.8 | POWER.6 35.56,4.36 33.6,2.4 14.2,2.4 13,3.6 13,9.8 | 13,9.8 10.8,12 6.2,12 J1.GNDBREAK 6.1,13.6 J1.GND
  Bottom 0.61: U2.9 11.44,31.56 10.8,32.2 10.8,41.2 12.2,42.6 12.2,54.8 | 12.2,54.8 v12.2,58.6 | v31.2,56 13.4,56 12.2,54.8
  Bottom 0.813: U2.9 14.4,31.07 14.4,23 11.4,20 6.4,20 3,16.6 J1.GND | POWER.6 35.78,4.78 37.6,6.6 52.4,6.6 54,5 54,2.4 55.8,0.6 96.4,0.6 97.6,1.8 97.6,6.6 96.4,7.8 93.92,7.8 X2.5
RESET
  Top 0.2: 35.8,26.6 35,26.6 U1.59
  Top 0.406: S1.1 S1.2 | S1.2 53.19,29.26 C14.2 53.6,30.4 | S1.2 50.26,29.26 47,26 36.4,26 35.8,26.6 | U$1.29 55.4,30.8 55,30.4 53.6,30.4 | R12.1 53.6,30.4
RXI
  Top 0.406: U$1.30 56.6,30 55.2,28.6 55.2,26.8 54.8,26.4 49.6,26.4 46.2,23 46.2,21.7 FDTI.3
SCL  (via drill 0.6)
  Top 0.406: U$1.28 56.2,31.6 54.8,33 54.8,35.2 54.9,35.3 | 54.9,35.3 55,35.4 55,38 | R14.1 54.85,35.35 54.9,35.3 | 55,38 56.2,39.2 56.2,41.6 56.8,42.2 58.6,42.2 58.59,42.19 U$2.6 | 55,38 54.4,38.6 v54.4,39
  Bottom 0.406: v54.4,39 50.8,42.6 30.4,42.6 28.4,44.6 28.4,47.81 SL030.4
SCLK  (via drill 0.6)
  Top 0.2: U1.30 26.8,31 27.6,30.2 27.6,29.2 v28.6,28.2 | v69.2,35.6 65.11,35.6 U$1.17
  Bottom 0.2: v28.6,28.2 32.2,28.2 33.4,29.4 41.2,29.4 42.8,31 69.8,31 70.2,31.4 70.2,35.2 69.8,35.6 v69.2,35.6 69.4,35.6
SCS  (via drill 0.6)
  Top 0.2: R10.1 23.2,28.45 IC1.2 23.2,31.2 23.4,31.4 U1.29 27.4,31.4 v28.6,30.2 | U$1.14 68,32.4 68.4,32 v69.2,32
  Bottom 0.2: v28.6,30.2 34.6,30.2 35,29.8 41,29.8 42.6,31.4 63.8,31.4 64.8,32.4 68,32.4 68.4,32 v69.2,32
SDA  (via drill 0.6)
  Top 0.406: U$1.27 56.8,32.4 56.2,33 56.2,35.35 R13.1 56.15,38.15 | 56.15,38.15 58.49,40.49 U$2.5 | 56.15,38.15 57.65,38.15 v58,37.8
  Bottom 0.406: v58,37.8 57.6,37.8 52,43.4 31.8,43.4 30.8,44.4 30.8,47.67 SL030.3
TXO
  Top 0.406: U$1.31 57,29.2 56,28.2 56,26.4 55.2,25.6 50.2,25.6 48.8,24.2 FDTI.2
VCC  (via drill 0.6)
  Top 0.305: U$1.18 64.2,31 63.4,30.2 U$1.6 63.4,28.4 | R17.1 71.6,40 70.8,40.8 v70.4,40.8 | R13.2 58.2,35.75 58.2,36.4 58.4,36.6 58.8,36.6 59.6,37.4 v59.6,37.8 | R14.2 53.15,36.15 v54,37 | v80.4,38.2 v85,38.2
  Top 0.406: R17.1 71.95,41.15 72.4,41.6 v75.2,41.6 | R21.2 55.2,1.6 v56.6,3 | R12.2 53.6,33.4 53.2,33.8 53.2,35.35 R14.2 | U$1.18 64.2,36.8 v64.8,37.4 | U$1.4 61.8,25.6 62.2,25.2 63,25.2 63.4,25.6 U$1.6
  Top 0.61: IC2.3 24,14.52 | 24,14.52 23.48,14.52 C18.A | R15.2 24.05,14.47 24,14.52 | C19.1 27.35,14.05 26.8,14.6 25.4,14.6 | 71.95,40.35 R17.1
  Top 0.813: 27.4,12.35 27.4,12.2 | D1.C 77.2,33.2 78.8,31.6 85.02,31.6 K1.1 | C18.A 24.8,16.8 v25.4,16.8 | 25.4,14.6 25.52,14.6 IC2.3 | 27.4,12.4 27.4,12.35 | 27.4,12.35 C19.1 | v61.2,46.8 59.8,46.8 58.8,47.8 v57.6,47.8
  Bottom 0.305: v70.4,40.8 70,40.8 | v59.6,37.8 59.6,38 | 61.4,34.4 61.2,34.2 61.2,33.8 60.2,32.8 58.6,32.8 58,33.4 | v54,37 54.2,37
  Bottom 0.406: v75.2,41.6 75.6,41.6 | v56.6,3 56.6,2.8 56.8,3 | 61.4,34.4 62,35 | v64.8,37.4 64.8,37.8
  Bottom 0.813: v25.4,16.8 26.2,16.8
  pour Bottom: 0,0 -0.2,20.8 39,20.8 39.2,52 0,52 0,64 100,64 100,0